# EAGLE design stm32_tiny_swd (EAGLE 7.7.0)
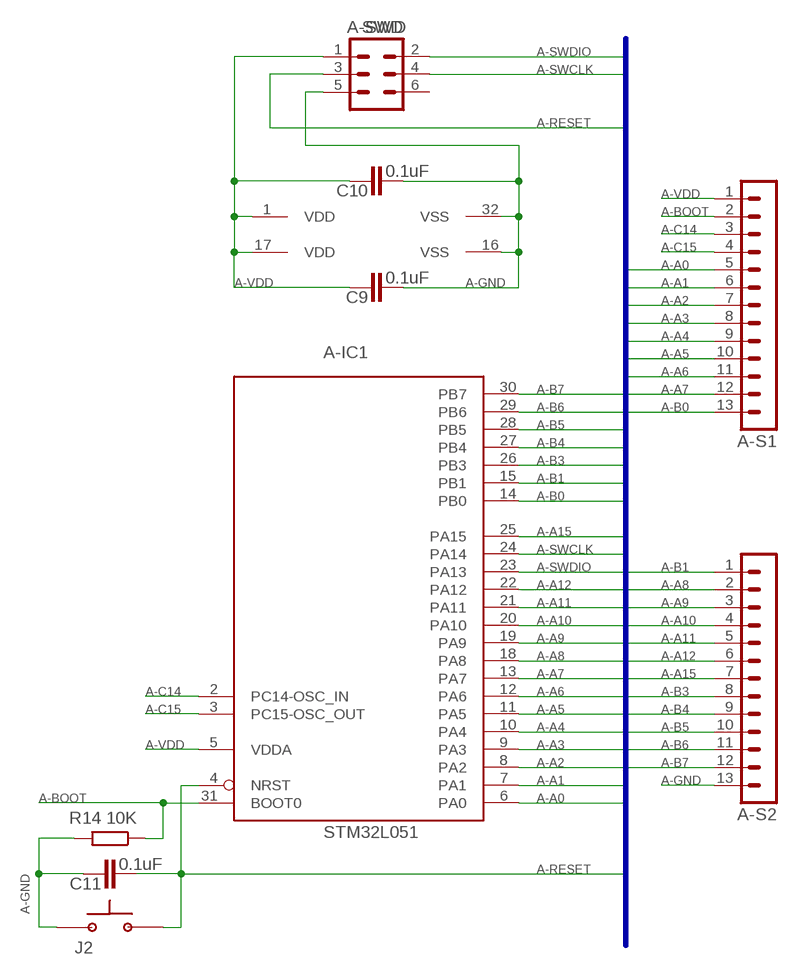
[diagram p0: schematic, sheet 1]

## Parts
A-IC1  STM32L051  STM32L051K8T  [LQFP32]
A-S1  MA13-1  [MA13-1]
A-S2  MA13-1  [MA13-1]
A-SWD  SWD  MA03-2  [MA03-2]
C9  0.1uF  C-EUC0805  [C0805]
C10  0.1uF  C-EUC0805  [C0805]
C11  0.1uF  C-EUC0805  [C0805]
J2  BUTTON-FSM14JRT  [BUTTON-FSM14JRT]
R14  10K  R-EU_R0805  [R0805]

## Nets
A-A0: A-IC1.6(PA0) A-S1.5
A-A1: A-IC1.7(PA1) A-S1.6
A-A2: A-IC1.8(PA2) A-S1.7
A-A3: A-IC1.9(PA3) A-S1.8
A-A4: A-IC1.10(PA4) A-S1.9
A-A5: A-IC1.11(PA5) A-S1.10
A-A6: A-IC1.12(PA6) A-S1.11
A-A7: A-IC1.13(PA7) A-S1.12
A-A8: A-IC1.18(PA8) A-S2.2
A-A9: A-IC1.19(PA9) A-S2.3
A-A10: A-IC1.20(PA10) A-S2.4
A-A11: A-IC1.21(PA11) A-S2.5
A-A12: A-IC1.22(PA12) A-S2.6
A-A15: A-IC1.25(PA15) A-S2.7
A-B0: A-IC1.14(PB0) A-S1.13
A-B1: A-IC1.15(PB1) A-S2.1
A-B3: A-IC1.26(PB3) A-S2.8
A-B4: A-IC1.27(PB4) A-S2.9
A-B5: A-IC1.28(PB5) A-S2.10
A-B6: A-IC1.29(PB6) A-S2.11
A-B7: A-IC1.30(PB7) A-S2.12
A-BOOT: A-IC1.31(BOOT0) A-S1.2 R14.1
A-C14: A-IC1.2(PC14-OSC_IN) A-S1.3
A-C15: A-IC1.3(PC15-OSC_OUT) A-S1.4
A-GND: A-IC1.16(VSS) A-IC1.32(VSS) A-S2.13 A-SWD.5 C9.2 C10.2 C11.1 J2.P$1 R14.2
A-RESET: A-IC1.4(NRST) A-SWD.3 C11.2 J2.P$2
A-SWCLK: A-IC1.24(PA14) A-SWD.4
A-SWDIO: A-IC1.23(PA13) A-SWD.2
A-VDD: A-IC1.1(VDD) A-IC1.5(VDDA) A-IC1.17(VDD) A-S1.1 A-SWD.1 C9.1 C10.1
Unconnected: A-SWD.6

## Buses
A-A0,A-A1,A-A2,A-A3,A-A4,A-A5,A-A6,A-A7,A-A8,A-A9,A-A10,A-A11,A-A12,A-A13,A-A14,A-A15,A-B0,A-B1,A-B2,A-B3,A-B4,A-B5,A-B6,A-B7,A-RESET,A-SWDIO,A-SWCLK

## Library data of the parts
A-IC1 = stm32:STM32L051K*T: ARM 32-bit Cortex™-M0+ CPU 32 MHz maximum frequency 32 to 64 Kbytes of Flash memory 2 kbyte of Data EEPROM 8 kbytes of SRAM 27 GPIOs 1.8 to 3.6 V application supply
A-S1 A-S2 = con-lstb:MA13-1: PIN HEADER; OC_FARNELL: unknown; OC_NEWARK: unknown
A-SWD = con-lstb:MA03-2: PIN HEADER; OC_FARNELL: unknown; OC_NEWARK: unknown
C9-C11 = rcl:C-EU: CAPACITOR, European symbol
J2 = MyComponents:BUTTON-FSM14JRT: TE Connectivity / Alcoswitch Round Switch; MOUSER: 506-1571010-1
R14 = rcl:R-EU_: RESISTOR, European symbol

## Board
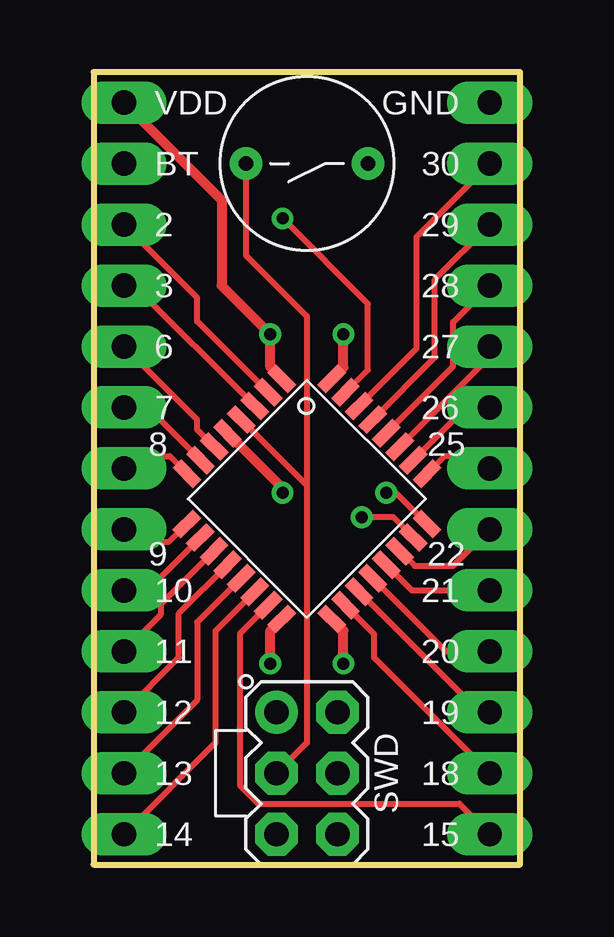
[diagram p1: board, top side]
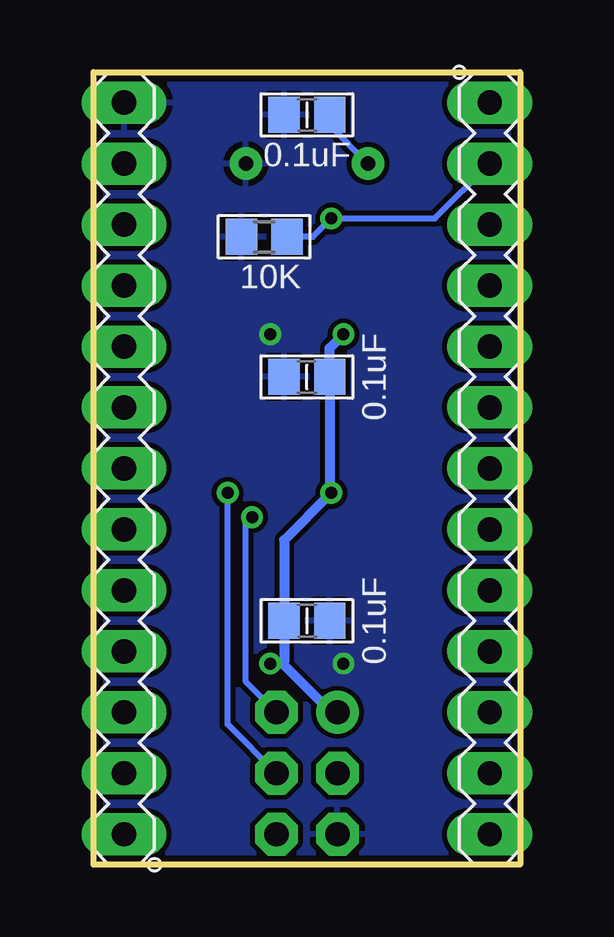
[diagram p2: board, bottom side, seen from below]

Size 17.78 x 33.02 mm. Coordinates in mm from the lower left corner, seen from the top.
Outline: 0,0 17.78,0 17.78,33.02 0,33.02 0,0
Copper layers (1*16): Top 0.035mm / dielectric 1.5mm / Bottom 0.035mm
Design rules "eagle": minimum track width 10mil, minimum drill 19mil, track to track 8mil, track to pad 8mil, pad to pad 7mil, via to via 12mil, smd to smd 7mil, copper to edge 10mil, drill to drill 30mil, minimum pad ring 15mil, minimum via ring 8mil, stop-mask expansion 4mil, vias tented up to drill 0mil, thermal gap 10mil

### Footprints (pad centres in the part's own frame; a part is rotated, then mirrored left to right if it is on the bottom)
LQFP32 = smd 0.5 x 1.2: 1 -2.8,-4.275; 2 -2,-4.275; 3 -1.2,-4.275; 4 -0.4,-4.275; 5 0.4,-4.275; 6 1.19,-4.275; 7 1.99,-4.275; 8 2.79,-4.275; 17 2.8,4.275; 18 2,4.275; 19 1.2,4.275; 20 0.4,4.275; 21 -0.4,4.275; 22 -1.2,4.275; 23 -2,4.275; 24 -2.8,4.275 | smd 1.2 x 0.5: 9 4.275,-2.8; 10 4.275,-2; 11 4.275,-1.2; 12 4.275,-0.4; 13 4.275,0.4; 14 4.275,1.2; 15 4.275,2; 16 4.275,2.8; 25 -4.275,2.8; 26 -4.275,2; 27 -4.275,1.2; 28 -4.275,0.4; 29 -4.275,-0.4; 30 -4.275,-1.2; 31 -4.275,-2; 32 -4.275,-2.8
MA13-1 = drill 1.016 long: 1 -15.24,0; 2 -12.7,0; 3 -10.16,0; 4 -7.62,0; 5 -5.08,0; 6 -2.54,0; 7 0,0; 8 2.54,0; 9 5.08,0; 10 7.62,0; 11 10.16,0; 12 12.7,0; 13 15.24,0
MA03-2 = drill 1.016: 1 -2.54,-1.27 | drill 1.016 octagon: 2 -2.54,1.27; 3 0,-1.27; 4 0,1.27; 5 2.54,-1.27; 6 2.54,1.27
C0805 = smd 1.3 x 1.5: 1 -0.95,0; 2 0.95,0
BUTTON-FSM14JRT = drill 0.6: P$1 -2.54,0; P$2 2.54,0
R0805 = smd 1.3 x 1.5: 1 -0.95,0; 2 0.95,0

### Placement (x,y rotation side)
A-IC1  8.89,15.24 225 top
A-S1  1.27,16.51 270 bottom
A-S2  16.51,16.51 90 bottom
A-SWD  8.89,3.81 270 top
C9  8.89,20.32 180 bottom
C10  8.89,10.16 0 bottom
C11  8.89,31.24 0 bottom
J2  8.89,29.21 180 top
R14  10.67,26.16 180 bottom

### Tracks (layer width: path | path; a pad name or v marks a point on that pad's centre or on a via)
A-A0
  Top 0.254: A-IC1.6 4.32,18.13 4.32,18.54 A-S1.5
A-A1
  Top 0.254: A-IC1.7 2.27,19.05 A-S1.6
A-A2
  Top 0.254: A-IC1.8 3.17,17.02 1.78,17.02 A-S1.7
A-A3
  Top 0.254: A-IC1.9 3.15,13.46 1.78,13.46 A-S1.8
A-A4
  Top 0.254: A-IC1.10 2.25,11.43 A-S1.9
A-A5
  Top 0.254: A-IC1.11 2.79,10.84 2.79,10.41 A-S1.10
A-A6
  Top 0.254: A-IC1.12 3.56,10.47 3.56,8.64 A-S1.11
A-A7
  Top 0.254: A-IC1.13 4.32,10.1 4.32,6.86 A-S1.12
A-A8
  Top 0.254: A-IC1.18 11.68,9.62 11.68,8.64 A-S2.2
A-A9
  Top 0.254: A-IC1.19 16.08,6.35 A-S2.3
A-A10
  Top 0.254: A-IC1.20 14.67,8.89 A-S2.4
A-A11
  Top 0.254: A-IC1.21 13.27,11.43 A-S2.5
A-A12
  Top 0.254: A-IC1.22 13.38,12.45 14.99,12.45 A-S2.6
A-A15
  Top 0.254: A-IC1.25 14.63,17.02 16,17.02 A-S2.7
A-B0
  Top 0.254: A-IC1.14 5.08,9.73 5.08,5.08 A-S1.13
A-B1
  Top 0.254: A-IC1.15 6.1,9.62 6.1,3.3 6.86,2.54 15.24,2.54 A-S2.1
A-B3
  Top 0.254: A-IC1.26 15.53,19.05 A-S2.8
A-B4
  Top 0.254: A-IC1.27 16.51,21.16 A-S2.9
A-B5
  Top 0.254: A-IC1.28 14.99,20.77 14.99,22.61 A-S2.10
A-B6
  Top 0.254: A-IC1.29 14.22,21.14 14.22,24.38 A-S2.11
A-B7
  Top 0.254: A-IC1.30 13.46,21.51 13.46,26.16 A-S2.12
A-BOOT  (via drill 0.5)
  Top 0.254: A-IC1.31 11.43,20.61 11.43,23.37 v7.87,26.92
  Bottom 0.254: 7.94,26.86 v7.87,26.92 | v7.87,26.92 3.56,26.92 A-S1.2 | v7.87,26.92 8.64,26.16 R14.1
A-C14
  Top 0.254: A-IC1.2 4.32,22.64 4.32,23.62 A-S1.3
A-C15
  Top 0.254: A-IC1.3 1.7,24.13 A-S1.4
A-GND  (via drill 0.5)
  Top 0.406: v7.37,8.38 7.37,9.76 A-IC1.16 | A-IC1.32 10.41,20.72 v10.41,22.1
  pour Bottom: 0,33.02 17.78,33.02 17.78,0 0,0
A-RESET
  Top 0.254: A-IC1.4 8.89,15.81 | 8.89,15.81 8.89,5.08 A-SWD.3 | 8.89,15.81 8.89,22.86 6.35,25.4 J2.P$2
  Bottom 0.254: J2.P$2 7.94,30.8 C11.2
A-SWCLK  (via drill 0.5)
  Top 0.254: A-IC1.24 12.6,15.49 v12.19,15.49
  Bottom 0.254: A-SWD.4 12.19,5.84 v12.19,15.49
A-SWDIO  (via drill 0.5)
  Top 0.254: A-IC1.23 12.48,14.48 v11.18,14.48
  Bottom 0.254: A-SWD.2 11.43,7.62 11.43,14.22 v11.18,14.48
A-VDD  (via drill 0.5)
  Top 0.406: v10.41,8.38 10.41,9.76 A-IC1.17 | A-IC1.1 7.37,20.72 v7.37,22.1 5.33,24.13 5.33,27.69 A-S1.1 | A-IC1.5 7.87,15.69 v7.87,15.49
  Bottom 0.254: 9.84,8.45 9.91,8.38
  Bottom 0.406: v10.41,8.38 9.91,8.38 7.87,6.35 A-SWD.1 | 9.84,8.45 C10.1 9.84,13.53 v7.87,15.49 7.94,15.43 C9.1 7.94,21.52 v7.37,22.1

### Text on the board
tNames: VDD | GND | BT | 30 | 2 | 29 | 3 | 28 | 6 | 27 | 7 | 26 | 8 | 25 | 9 | 22 | 10 | 21 | 11 | 20 | 12 | 19 | 13 | 18 | 14 | 15